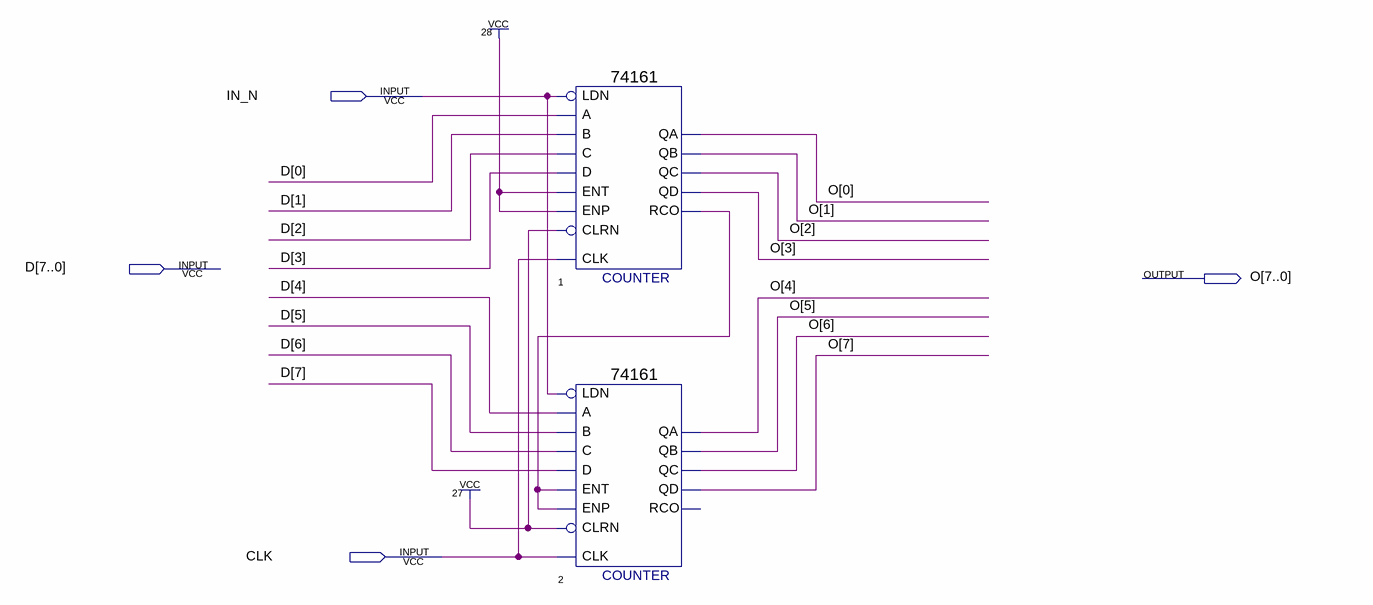
[diagram p0: schematic sheet]
// Quartus schematic Counter_8bit.bdf as structural Verilog: 2 symbols, 4 pins
module Counter_8bit (
  input  IN_N,
  input  [7:0] D,
  input  CLK,
  output [7:0] O
);

  wire n1_rco;

  \74161  u_1 (
    .LDN(IN_N), .A(D[0]), .ENT(1'b1), .D(D[3]), .C(D[2]), .B(D[1]), .CLRN(1'b1), .CLK(CLK), .ENP(1'b1),
    .QD(O[3]), .QC(O[2]), .QB(O[1]), .QA(O[0]), .RCO(n1_rco));
  \74161  u_2 (
    .LDN(IN_N), .A(D[4]), .ENT(n1_rco), .D(D[7]), .C(D[6]), .B(D[5]), .CLRN(1'b1), .CLK(CLK), .ENP(n1_rco),
    .QD(O[7]), .QC(O[6]), .QB(O[5]), .QA(O[4]));  // open: RCO
endmodule
